# EAGLE design jackboardD (EAGLE 7.5.0)
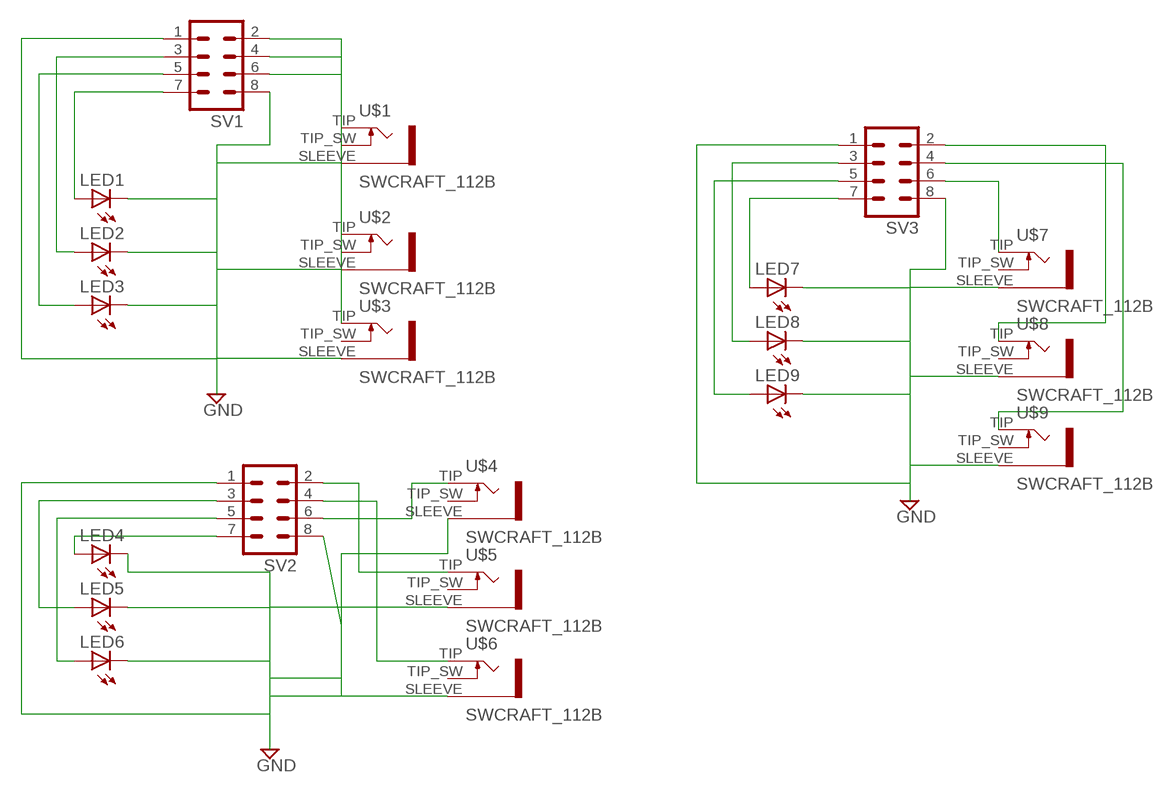
[diagram p0: schematic, sheet 1]

## Parts
LED1  LED5MM  [LED5MM]
LED2  LED5MM  [LED5MM]
LED3  LED5MM  [LED5MM]
LED4  LED5MM  [LED5MM]
LED5  LED5MM  [LED5MM]
LED6  LED5MM  [LED5MM]
LED7  LED5MM  [LED5MM]
LED8  LED5MM  [LED5MM]
LED9  LED5MM  [LED5MM]
SV1  MA04-2  [MA04-2]
SV2  MA04-2  [MA04-2]
SV3  MA04-2  [MA04-2]
U$1  SWCRAFT_112B  [SWCRAFT_112_SLOTS]
U$2  SWCRAFT_112B  [SWCRAFT_112_SLOTS]
U$3  SWCRAFT_112B  [SWCRAFT_112_SLOTS]
U$4  SWCRAFT_112B  [SWCRAFT_112_SLOTS]
U$5  SWCRAFT_112B  [SWCRAFT_112_SLOTS]
U$6  SWCRAFT_112B  [SWCRAFT_112_SLOTS]
U$7  SWCRAFT_112B  [SWCRAFT_112_SLOTS]
U$8  SWCRAFT_112B  [SWCRAFT_112_SLOTS]
U$9  SWCRAFT_112B  [SWCRAFT_112_SLOTS]

## Nets
GND: LED2.K(C) LED5.K(C) LED7.K(C) LED8.K(C) SV2.1 SV2.8 SV3.1 U$1.SLEEVE U$5.SLEEVE U$6.SLEEVE U$7.SLEEVE
N$1: LED1.A SV1.7
N$2: LED2.A SV1.3
N$3: LED3.A SV1.5
N$5: SV1.6 U$1.TIP
N$7: SV1.2 U$2.TIP
N$8: LED4.K(C) LED6.K(C) U$4.SLEEVE
N$9: SV1.4 U$3.TIP
N$11: LED1.K(C) LED3.K(C) SV1.1 SV1.8 U$2.SLEEVE U$3.SLEEVE
N$12: LED6.A SV2.5
N$13: LED4.A SV2.7
N$14: LED5.A SV2.3
N$15: SV2.2 U$5.TIP
N$16: SV2.4 U$6.TIP
N$17: SV2.6 U$4.TIP
N$18: LED9.K(C) SV3.8 U$8.SLEEVE U$9.SLEEVE
N$19: LED7.A SV3.7
N$20: LED9.A SV3.5
N$21: LED8.A SV3.3
N$22: SV3.2 U$8.TIP
N$23: SV3.4 U$9.TIP
N$24: SV3.6 U$7.TIP
Unconnected: U$1.TIP_SW U$2.TIP_SW U$3.TIP_SW U$4.TIP_SW U$5.TIP_SW U$6.TIP_SW U$7.TIP_SW U$8.TIP_SW U$9.TIP_SW

## Library data of the parts
LED1-LED9 = led:LED: LED OSRAM: - CHIPLED LG R971, LG N971, LY N971, LG Q971, LY Q971, LO R971, LY R971 LH N974, LH R974 LS Q976, LO Q976, LY Q976 LO Q996 - Hyper CHIPLED LW Q18S LB Q993, LB Q99A, LB R99A - SideLED LS A670, LO A670, LY A670, LG A670, LP A670 LB A673, LV A673, LT A673, LW A673 LH A674 LY A675 LS A676, LA A676, LO A676, LY A676, LW A676 LS A679, LY A679, LG A679 - Hyper Micro SIDELED® LS Y876, LA Y876, LO Y876, LY Y876 LT Y87S - SmartLED LW L88C, LW L88S LB L89C, LB L89S, LG L890 LS L89K, LO L89K, LY L89K LS L896, LA L896, LO L896, LY L896 - TOPLED LS T670, LO T670, LY T670, LG T670, LP T670 LSG T670, LSP T670, LSY T670, LOP T670, LYG T670 LG T671, LOG T671, LSG T671 LB T673, LV T673, LT T673, LW T673 LH T674 LS T676, LA T676, LO T676, LY T676, LB T676, LH T676, LSB T676, LW T676 LB T67C, LV T67C, LT T67C, LS T67K, LO T67K, LY T67K, LW E67C LS E67B, LA E67B, LO E67B, LY E67B, LB E67C, LV E67C, LT E67C LW T67C LS T679, LY T679, LG T679 LS T770, LO T770, LY T770, LG T770, LP T770 LB T773, LV T773, LT T773, LW T773 LH T774 LS E675, LA E675, LY E675, LS T675 LS T776, LA T776, LO T776, LY T776, LB T776 LHGB T686 LT T68C, LB T68C - Hyper Mini TOPLED® LB M676 - Mini TOPLED Santana® LG M470 LS M47K, LO M47K, LY M47K Source: http://www.osram.convergy.de LUXEON: - LUMILED® LXK2-PW12-R00, LXK2-PW12-S00, LXK2-PW14-U00, LXK2-PW14-V00 LXK2-PM12-R00, LXK2-PM12-S00, LXK2-PM14-U00 LXK2-PE12-Q00, LXK2-PE12-R00, LXK2-PE12-S00, LXK2-PE14-T00, LXK2-PE14-U00 LXK2-PB12-K00, LXK2-PB12-L00, LXK2-PB12-M00, LXK2-PB14-N00, LXK2-PB14-P00, LXK2-PB14-Q00 LXK2-PR12-L00, LXK2-PR12-M00, LXK2-PR14-Q00, LXK2-PR14-R00 LXK2-PD12-Q00, LXK2-PD12-R00, LXK2-PD12-S00 LXK2-PH12-R00, LXK2-PH12-S00 LXK2-PL12-P00, LXK2-PL12-Q00, LXK2-PL12-R00 Source: www.luxeon.com KINGBRIGHT: KA-3528ASYC Source: www.kingbright.com
SV1-SV3 = con-lstb:MA04-2: PIN HEADER; OC_FARNELL: unknown; OC_NEWARK: unknown
U$1-U$9 = switchcraft:SWCRAFT_112B

## Board
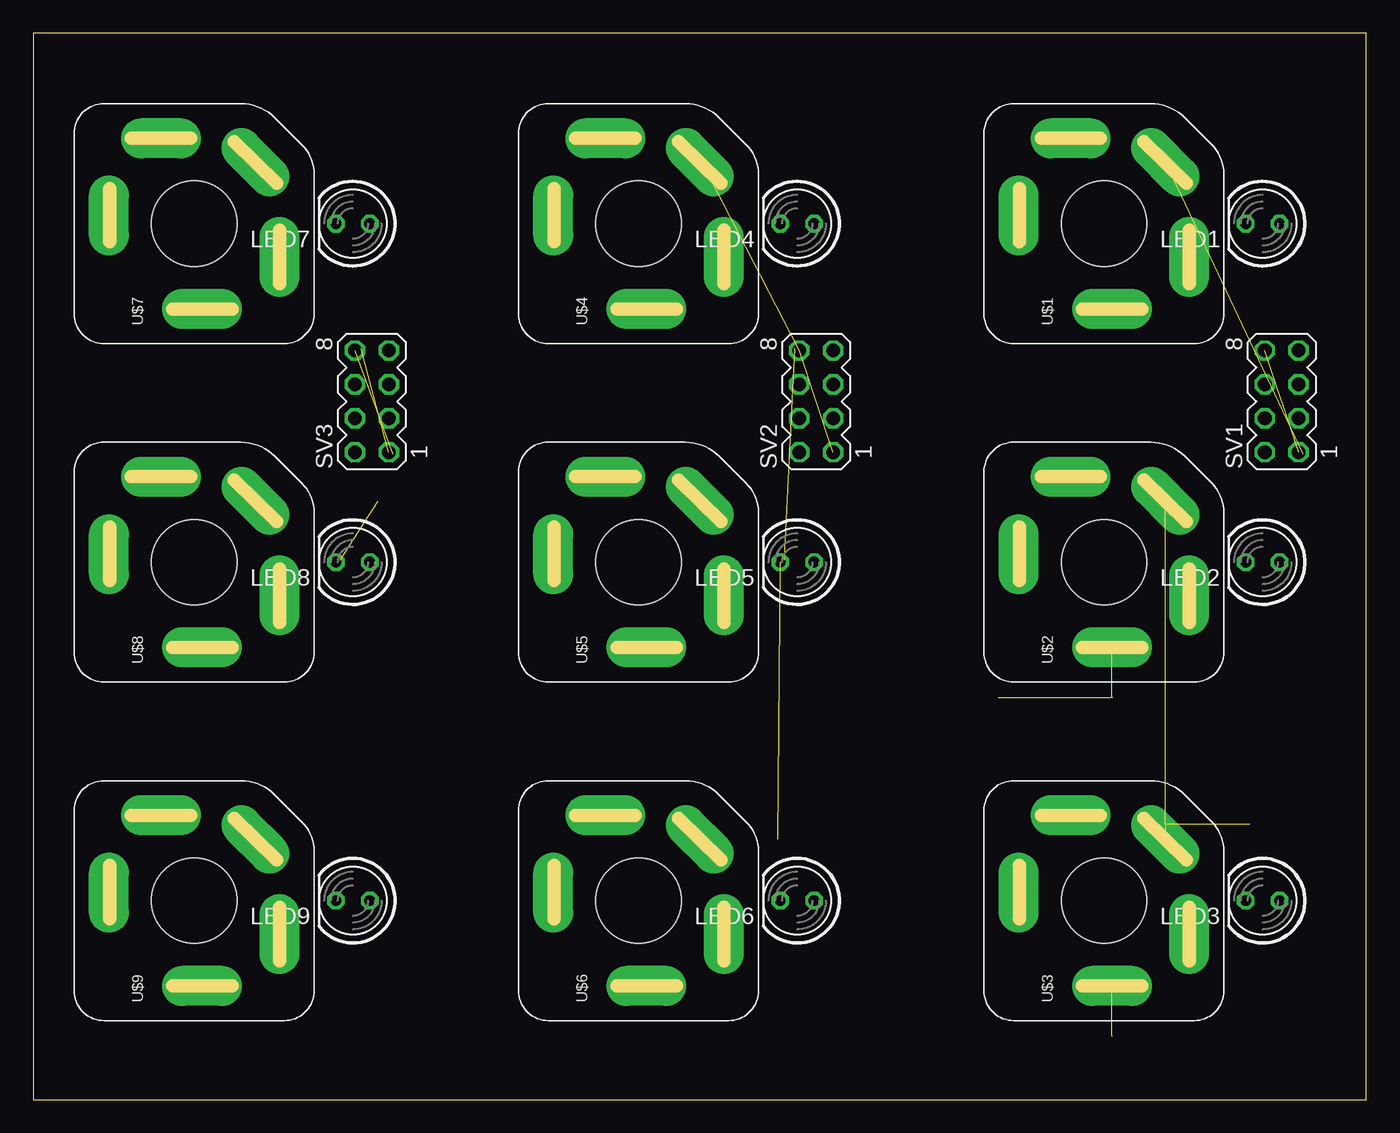
[diagram p1: board, top side]
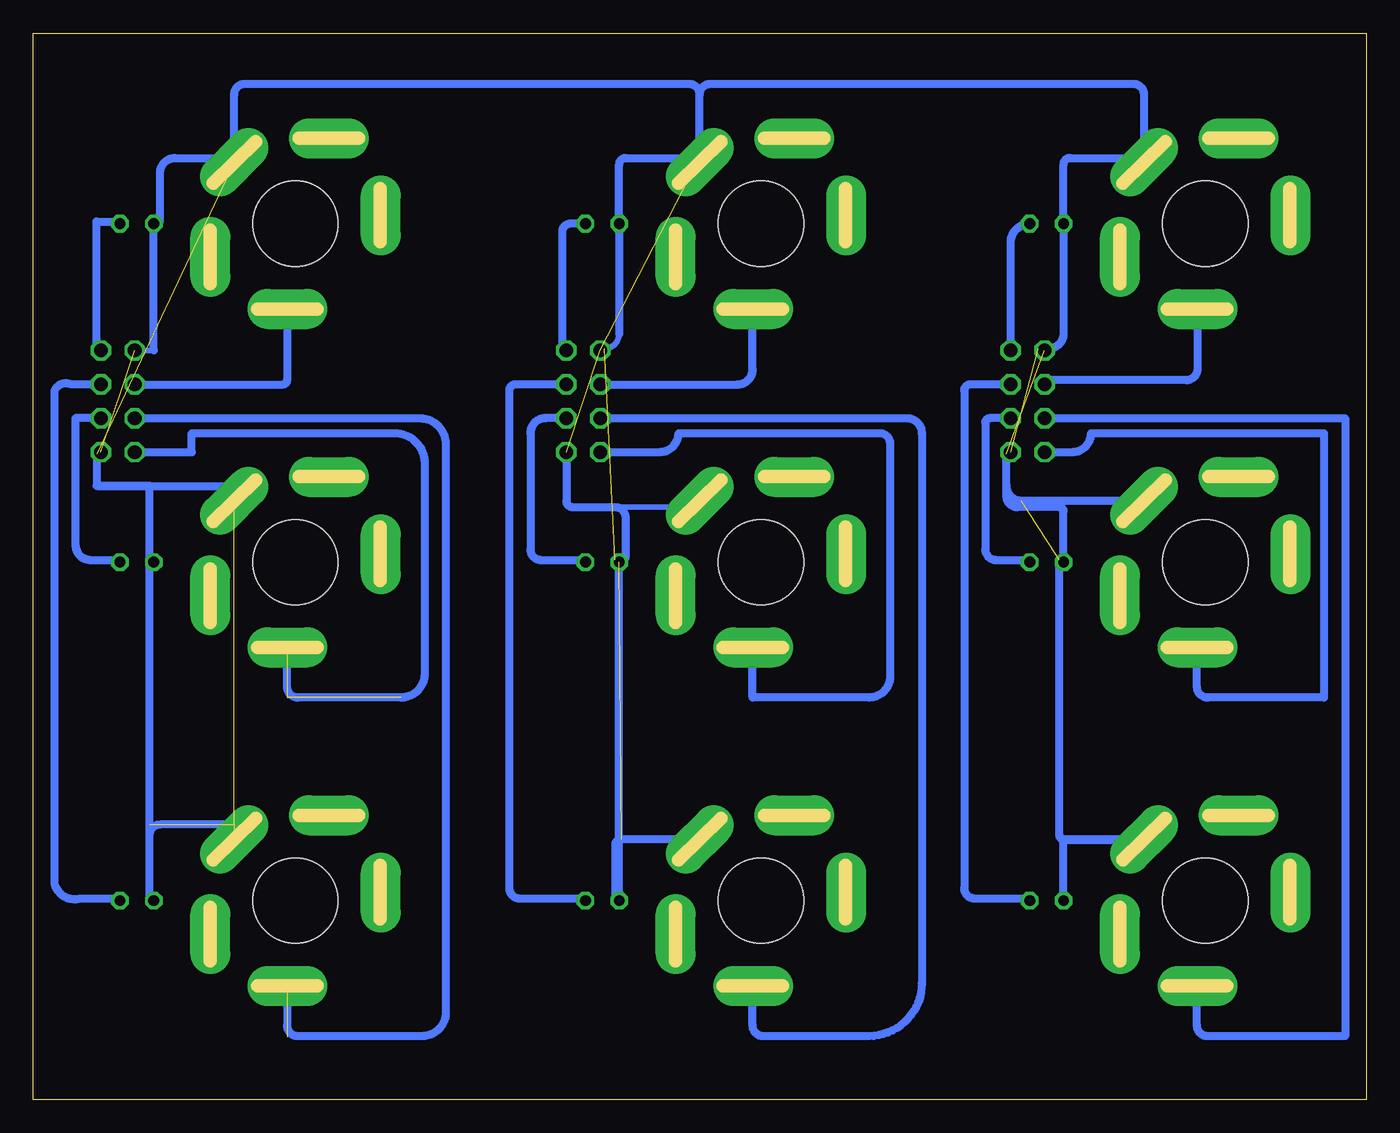
[diagram p2: board, bottom side, seen from below]

Size 100 x 80 mm. Coordinates in mm from the lower left corner, seen from the top.
Outline: 0,0 100,0 100,80 0,80 0,0
Copper layers (1*16): Top 0.035mm / dielectric 1.5mm / Bottom 0.035mm
Design rules "default": minimum track width 10mil, minimum drill 24mil, track to track 8mil, track to pad 8mil, pad to pad 8mil, via to via 8mil, smd to smd 8mil, copper to edge 40mil, drill to drill 8mil, minimum pad ring 10mil, minimum via ring 8mil, stop-mask expansion 4mil, vias tented up to drill 0mil, thermal gap 10mil

### Footprints (pad centres in the part's own frame; a part is rotated, then mirrored left to right if it is on the bottom)
LED5MM = drill 0.813 octagon: A -1.27,0; K 1.27,0
MA04-2 = drill 1.016 octagon: 1 -3.81,-1.27; 2 -3.81,1.27; 3 -1.27,-1.27; 4 -1.27,1.27; 5 1.27,-1.27; 6 1.27,1.27; 7 3.81,-1.27; 8 3.81,1.27
SWCRAFT_112_SLOTS = drill 0.45 pad 3 long: RING 0.6,6.4; RING_SW 6.4,2.5; SLEEVE 4.6,-4.6; TIP -6.4,-0.6; TIP_SW -2.5,-6.4 | hole 6.4: 0,0

### Placement (x,y rotation side)
DRILEGEND  [DRILEGEND]  0,-3.81 0 top  (outside the outline)
LED1  92.23,65.72 180 top
LED2  92.23,40.32 180 top
LED3  92.23,14.92 180 top
LED4  57.31,65.72 180 top
LED5  57.31,40.32 180 top
LED6  57.31,14.92 180 top
LED7  23.97,65.72 180 top
LED8  23.97,40.32 180 top
LED9  23.97,14.92 180 top
SV1  93.66,52.39 90 top
SV2  58.74,52.39 90 top
SV3  25.4,52.39 90 top
U$1  80.33,65.72 90 top
U$2  80.33,40.32 90 top
U$3  80.33,14.92 90 top
U$4  45.4,65.72 90 top
U$5  45.4,40.32 90 top
U$6  45.4,14.92 90 top
U$7  12.06,65.72 90 top
U$8  12.06,40.32 90 top
U$9  12.06,14.92 90 top

### Tracks (layer width: path | path; a pad name or v marks a point on that pad's centre or on a via)
GND  (5 unrouted)
  Bottom 0.406: LED2.K 91.28,40.32 | 91.28,46.04 84.93,46.04 | 95.25,46.04 95.25,48.42 | 60.01,44.93 arc-90 59.53,44.45 50.48,44.45 arc-90 U$5.SLEEVE
  Bottom 0.61: 91.28,40.32 91.28,46.04 95.25,46.04 | 84.93,46.04 84.93,45.24 | U$6.SLEEVE 55.88,19.52 arc-90 56.36,19.05 56.36,15.08 | U$1.SLEEVE 84.93,75.41 arc90 84.14,76.2 50.8,76.2 arc90 50.01,75.41 | SV2.1 60.01,44.93 arc-90 59.53,44.45 56.36,44.45 arc90 55.56,43.66 55.56,40.8 arc90 LED5.K | 24.61,56.36 23.81,56.36 arc-90 22.7,57.47 LED7.K 22.7,70.17 arc90 22.23,70.64 16.99,70.64 arc90 U$7.SLEEVE arc90 U$7.SLEEVE 16.67,75.41 arc-90 17.46,76.2 49.21,76.2 arc-90 50.01,75.41 | 50.01,70.64 50.01,75.41 | LED8.K 22.7,44.13 arc-90 23.02,44.45 26.19,44.45 arc90 26.99,45.24 26.99,48.26 arc90 SV3.1
N$1
  Bottom 0.406: SV1.7 95.25,56.2 | 93.5,65.88 LED1.A
  Bottom 0.61: 95.25,56.2 95.25,65.88 93.5,65.88
N$2
  Bottom 0.406: 93.5,40.48 LED2.A
  Bottom 0.61: SV1.3 96.84,51.12 96.84,41.6 arc-90 95.72,40.48 93.5,40.48
N$3
  Bottom 0.406: 93.5,15.08 LED3.A
  Bottom 0.61: SV1.5 97.16,53.66 arc-90 98.42,53.18 98.42,16.2 arc-90 96.51,15.08 93.5,15.08
N$4
  Bottom 0.61: 91.28,15.08 91.28,40.48
N$5
  Bottom 0.406: 80.96,53.98 arc-90 80.93,54.01
  Bottom 0.61: SV1.6 81.28,53.66 arc-90 80.96,53.98 | 80.93,54.01 U$1.TIP
N$6
  Bottom 0.406: 91.28,65.88 90.49,65.88
  Bottom 0.61: 90.49,65.88 90.49,69.52 arc90 89.36,70.64 84.93,70.64
N$7  (3 unrouted)
  Bottom 0.61: SV1.2 88.11,48.58 88.11,50.01 72.89,50.01 arc90 70.64,47.76 70.64,31.94 arc90 72.42,30.16
N$8  (1 unrouted)
  Bottom 0.406: 56.04,57.47 arc90 57.15,56.36 57.94,56.36
  Bottom 0.61: 56.04,57.47 LED4.K 56.04,70.17 arc90 55.56,70.64 50.32,70.64 arc90 U$4.SLEEVE | LED6.K 56.04,40.16 arc-90 56.36,40.48
N$9  (2 unrouted)
  Bottom 0.61: SV1.4 70.99,51.12 arc90 69.06,49.18 69.06,6.54 arc90 70.83,4.76 80.17,4.76 arc90 80.96,5.56 80.93,5.56 U$3.TIP
N$10
  Bottom 0.61: 72.23,30.16 80.17,30.16 arc90 80.96,30.96 80.96,34.13
N$11  (4 unrouted)
  Bottom 0.406: LED3.K 91.28,14.92 91.28,19.84 91.28,20.64 | SV1.8 90.96,56.2 | SV1.1 95.25,48.58 | 84.93,46.04 U$2.SLEEVE
  Bottom 0.61: 84.93,19.84 arc-90 85.72,20.64 90.49,20.64 arc-90 91.28,19.84 | 90.96,56.2 LED1.K | 95.25,48.58 95.25,46.04 84.93,46.04
N$12
  Bottom 0.61: SV2.5 63.82,53.66 arc-90 64.29,53.18 64.29,15.88 arc-90 63.5,15.08 58.74,15.08 arc90 LED6.A
N$13
  Bottom 0.406: 60.33,56.52 arc-90 SV2.7
  Bottom 0.61: LED4.A 59.69,65.72 arc-90 60.33,65.09 60.33,56.52
N$14
  Bottom 0.61: SV2.3 61.59,51.12 arc-90 62.71,50.01 62.71,41.27 arc-90 61.91,40.48 58.74,40.48 arc90 LED5.A
N$15
  Bottom 0.61: SV2.2 53.02,48.58 arc-90 51.59,50.01 36.51,50.01 arc90 35.72,49.21 35.72,31.75 arc90 37.31,30.16 46.04,30.16 46.04,33.89 arc90 U$5.TIP
N$16
  Bottom 0.61: SV2.4 34.45,51.12 arc90 33.34,50.01 33.34,8.73 arc90 37.31,4.76 45.24,4.76 arc90 46.04,5.56 46.04,8.49 arc90 U$6.TIP
N$17
  Bottom 0.406: 46.04,59.29 arc90 U$4.TIP
  Bottom 0.61: SV2.6 47.15,53.66 arc-90 46.04,54.77 46.04,59.29
N$18  (2 unrouted)
  Bottom 0.406: 22.7,19.37 16.66,19.37 U$9.SLEEVE
  Bottom 0.61: LED9.K 22.7,19.37 | U$8.SLEEVE 25.87,44.92 arc90 26.99,46.04 26.99,48.42 | U$9.SLEEVE 22.7,19.52 arc90 23.02,19.84 23.02,40.48
N$19
  Bottom 0.61: SV3.7 26.67,64.29 arc90 LED7.A
N$20
  Bottom 0.61: SV3.5 29.69,53.66 arc-90 30.16,53.18 30.16,15.88 arc-90 29.37,15.08 25.4,15.08 arc90 LED9.A
N$21
  Bottom 0.61: SV3.3 28.26,51.12 arc-90 28.57,50.8 28.57,41.27 arc-90 27.78,40.48 25.4,40.48 arc90 LED8.A
N$22
  Bottom 0.61: SV3.2 22.07,48.58 arc-90 20.64,50.01 3.17,50.01 3.17,30.16 11.91,30.16 arc90 12.7,30.96 12.7,33.89 arc90 U$8.TIP
N$23
  Bottom 0.61: SV3.4 1.59,51.12 1.59,4.76 11.91,4.76 arc90 12.7,5.56 12.7,8.49 arc90 U$9.TIP
N$24
  Bottom 0.61: U$7.TIP 12.66,54.8 arc90 13.49,53.98 23.81,53.98 arc-90 SV3.6

### Text on the board
DrillLegend: LAYER-STACK
DrillLegend_01-16: 01-16
DrillLegend_01-20: 01-20